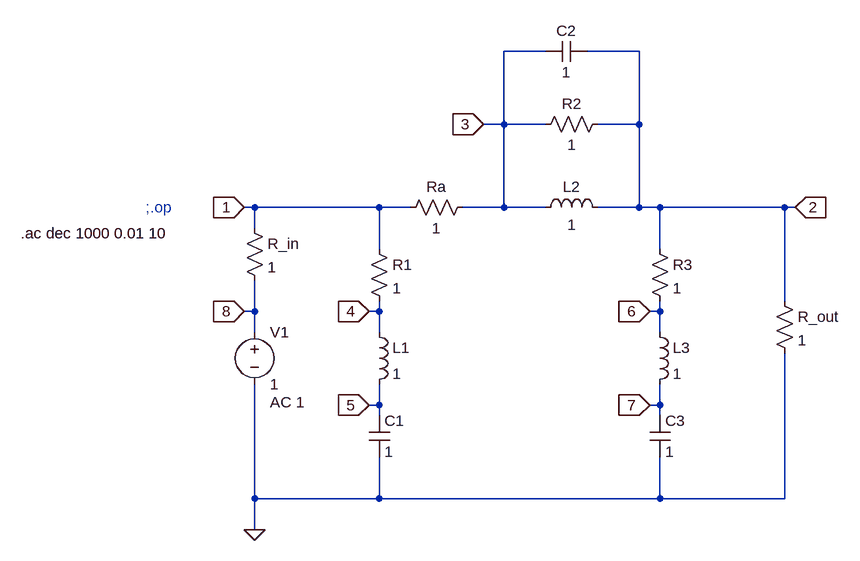
[diagram p0: schematic Pi-Filter.asc]
Pi-Filter.asc, the LTspice schematic file:
Version 4
SHEET 1 944 680
WIRE 480 -224 416 -224
WIRE 624 -224 544 -224
WIRE 416 -112 416 -224
WIRE 416 -112 384 -112
WIRE 480 -112 416 -112
WIRE 624 -112 624 -224
WIRE 624 -112 560 -112
WIRE 32 16 16 16
WIRE 224 16 32 16
WIRE 272 16 224 16
WIRE 416 16 416 -112
WIRE 416 16 352 16
WIRE 480 16 416 16
WIRE 624 16 624 -112
WIRE 624 16 560 16
WIRE 656 16 624 16
WIRE 848 16 656 16
WIRE 864 16 848 16
WIRE 32 48 32 16
WIRE 224 80 224 16
WIRE 656 80 656 16
WIRE 848 160 848 16
WIRE 32 176 32 128
WIRE 32 176 16 176
WIRE 224 176 224 160
WIRE 224 176 208 176
WIRE 656 176 656 160
WIRE 656 176 640 176
WIRE 32 208 32 176
WIRE 224 208 224 176
WIRE 656 208 656 176
WIRE 224 320 224 288
WIRE 224 320 208 320
WIRE 656 320 656 288
WIRE 656 320 640 320
WIRE 224 336 224 320
WIRE 656 336 656 320
WIRE 32 464 32 288
WIRE 224 464 224 400
WIRE 224 464 32 464
WIRE 656 464 656 400
WIRE 656 464 224 464
WIRE 848 464 848 240
WIRE 848 464 656 464
WIRE 32 512 32 464
FLAG 32 512 0
FLAG 16 16 1
IOPIN 16 16 In
FLAG 384 -112 3
IOPIN 384 -112 In
FLAG 864 16 2
IOPIN 864 16 In
FLAG 208 176 4
IOPIN 208 176 In
FLAG 208 320 5
IOPIN 208 320 In
FLAG 640 320 7
IOPIN 640 320 In
FLAG 640 176 6
IOPIN 640 176 In
FLAG 16 176 8
IOPIN 16 176 In
SYMBOL voltage 32 192 R0
WINDOW 123 24 124 Left 2
WINDOW 39 0 0 Left 0
SYMATTR Value2 AC 1
SYMATTR InstName V1
SYMATTR Value 1
SYMBOL res 16 32 R0
SYMATTR InstName R_in
SYMATTR Value 1
SYMBOL res 208 64 R0
SYMATTR InstName R1
SYMATTR Value 1
SYMBOL res 368 0 R90
WINDOW 0 0 56 VBottom 2
WINDOW 3 32 56 VTop 2
SYMATTR InstName Ra
SYMATTR Value 1
SYMBOL res 576 -128 R90
WINDOW 0 0 56 VBottom 2
WINDOW 3 32 56 VTop 2
SYMATTR InstName R2
SYMATTR Value 1
SYMBOL res 640 64 R0
SYMATTR InstName R3
SYMATTR Value 1
SYMBOL res 832 144 R0
SYMATTR InstName R_out
SYMATTR Value 1
SYMBOL ind 208 192 R0
SYMATTR InstName L1
SYMATTR Value 1
SYMATTR SpiceLine Rser=0
SYMBOL ind 464 32 R270
WINDOW 0 32 56 VTop 2
WINDOW 3 5 56 VBottom 2
SYMATTR InstName L2
SYMATTR Value 1
SYMATTR SpiceLine Rser=0
SYMBOL ind 640 192 R0
SYMATTR InstName L3
SYMATTR Value 1
SYMATTR SpiceLine Rser=0
SYMBOL cap 208 336 R0
SYMATTR InstName C1
SYMATTR Value 1
SYMBOL cap 544 -240 R90
WINDOW 0 0 32 VBottom 2
WINDOW 3 32 32 VTop 2
SYMATTR InstName C2
SYMATTR Value 1
SYMBOL cap 640 336 R0
SYMATTR InstName C3
SYMATTR Value 1
TEXT -136 16 Left 2 ;;.op
TEXT -328 56 Left 2 !.ac dec 1000 0.01 10

The netlist it stands for:
* Pi-Filter.asc
V1 8 0 1 AC 1
R_in 1 8 1
R1 1 4 1
Ra 3 1 1
R2 2 3 1
R3 2 6 1
R_out 2 0 1
L1 4 5 1 Rser=0
L2 3 2 1 Rser=0
L3 6 7 1 Rser=0
C1 5 0 1
C2 2 3 1
C3 7 0 1
* ;.op
.ac dec 1000 0.01 10
.backanno
.end